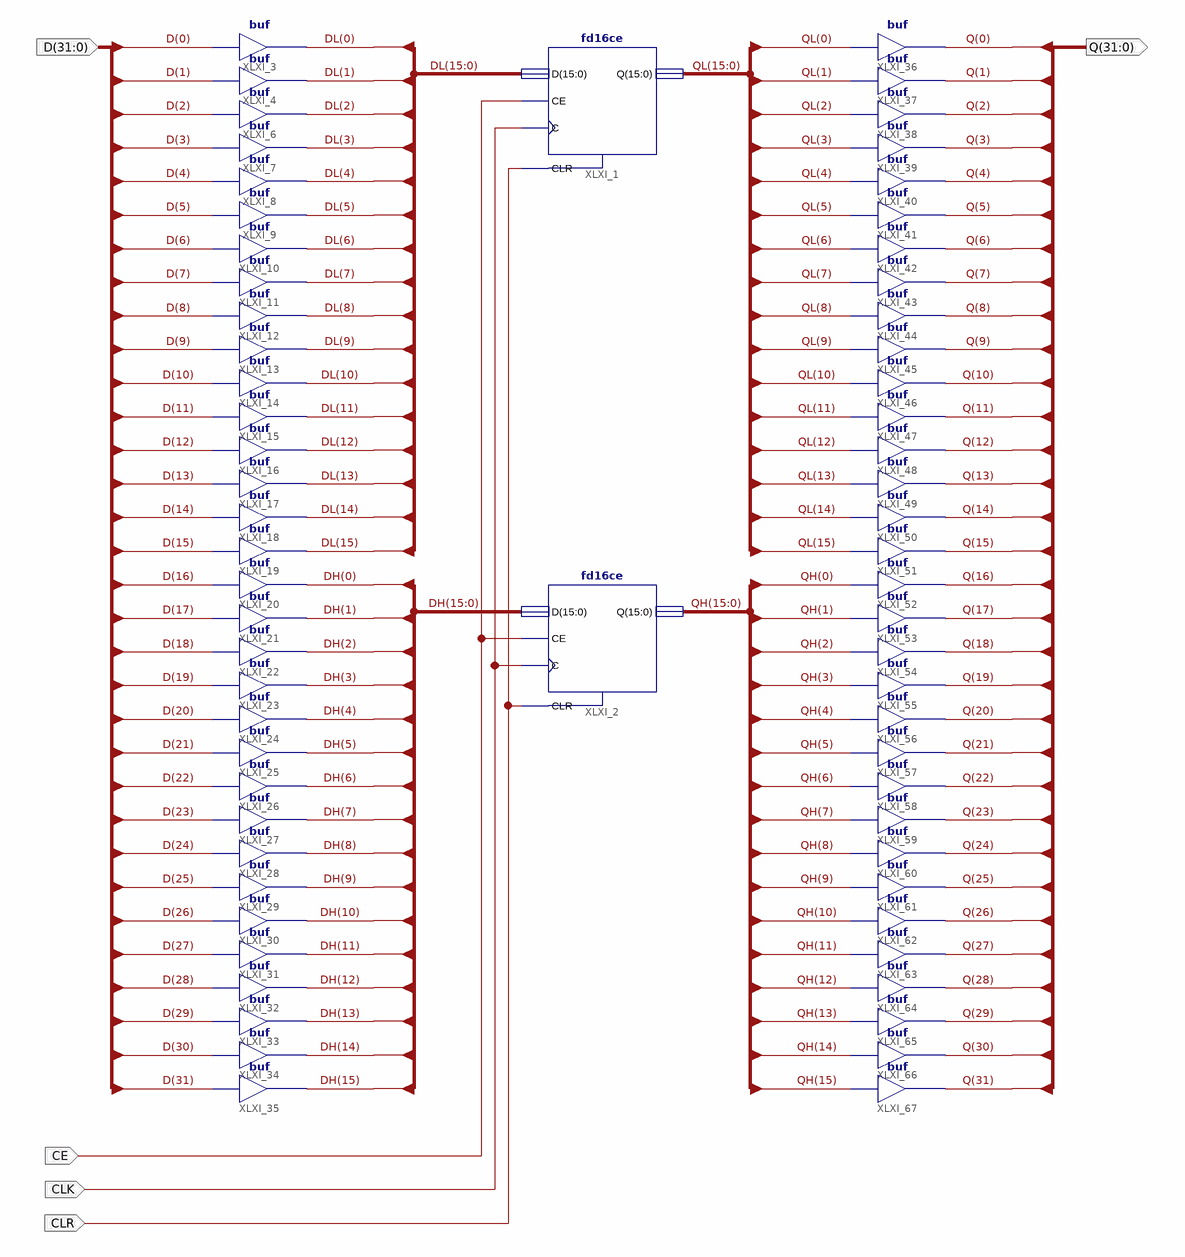
[diagram p0: schematic sheet 1]
// Xilinx ISE schematic fd32ce.sch (spartan6) as structural Verilog: 66 symbols, 5 ports
module fd32ce (
  input  [31:0] D,
  input  CLR,
  input  CLK,
  input  CE,
  output [31:0] Q
);

  wire [15:0] DH, DL, QH, QL;

  fd16ce XLXI_1 (.C(CLK), .CE(CE), .CLR(CLR), .D(DL), .Q(QL));
  fd16ce XLXI_2 (.C(CLK), .CE(CE), .CLR(CLR), .D(DH), .Q(QH));
  buf XLXI_3 (DL[0], D[0]);
  buf XLXI_4 (DL[1], D[1]);
  buf XLXI_6 (DL[2], D[2]);
  buf XLXI_7 (DL[3], D[3]);
  buf XLXI_8 (DL[4], D[4]);
  buf XLXI_9 (DL[5], D[5]);
  buf XLXI_10 (DL[6], D[6]);
  buf XLXI_11 (DL[7], D[7]);
  buf XLXI_12 (DL[8], D[8]);
  buf XLXI_13 (DL[9], D[9]);
  buf XLXI_14 (DL[10], D[10]);
  buf XLXI_15 (DL[11], D[11]);
  buf XLXI_16 (DL[12], D[12]);
  buf XLXI_17 (DL[13], D[13]);
  buf XLXI_18 (DL[14], D[14]);
  buf XLXI_19 (DL[15], D[15]);
  buf XLXI_20 (DH[0], D[16]);
  buf XLXI_21 (DH[1], D[17]);
  buf XLXI_22 (DH[2], D[18]);
  buf XLXI_23 (DH[3], D[19]);
  buf XLXI_24 (DH[4], D[20]);
  buf XLXI_25 (DH[5], D[21]);
  buf XLXI_26 (DH[6], D[22]);
  buf XLXI_27 (DH[7], D[23]);
  buf XLXI_28 (DH[8], D[24]);
  buf XLXI_29 (DH[9], D[25]);
  buf XLXI_30 (DH[10], D[26]);
  buf XLXI_31 (DH[11], D[27]);
  buf XLXI_32 (DH[12], D[28]);
  buf XLXI_33 (DH[13], D[29]);
  buf XLXI_34 (DH[14], D[30]);
  buf XLXI_35 (DH[15], D[31]);
  buf XLXI_36 (Q[0], QL[0]);
  buf XLXI_37 (Q[1], QL[1]);
  buf XLXI_38 (Q[2], QL[2]);
  buf XLXI_39 (Q[3], QL[3]);
  buf XLXI_40 (Q[4], QL[4]);
  buf XLXI_41 (Q[5], QL[5]);
  buf XLXI_42 (Q[6], QL[6]);
  buf XLXI_43 (Q[7], QL[7]);
  buf XLXI_44 (Q[8], QL[8]);
  buf XLXI_45 (Q[9], QL[9]);
  buf XLXI_46 (Q[10], QL[10]);
  buf XLXI_47 (Q[11], QL[11]);
  buf XLXI_48 (Q[12], QL[12]);
  buf XLXI_49 (Q[13], QL[13]);
  buf XLXI_50 (Q[14], QL[14]);
  buf XLXI_51 (Q[15], QL[15]);
  buf XLXI_52 (Q[16], QH[0]);
  buf XLXI_53 (Q[17], QH[1]);
  buf XLXI_54 (Q[18], QH[2]);
  buf XLXI_55 (Q[19], QH[3]);
  buf XLXI_56 (Q[20], QH[4]);
  buf XLXI_57 (Q[21], QH[5]);
  buf XLXI_58 (Q[22], QH[6]);
  buf XLXI_59 (Q[23], QH[7]);
  buf XLXI_60 (Q[24], QH[8]);
  buf XLXI_61 (Q[25], QH[9]);
  buf XLXI_62 (Q[26], QH[10]);
  buf XLXI_63 (Q[27], QH[11]);
  buf XLXI_64 (Q[28], QH[12]);
  buf XLXI_65 (Q[29], QH[13]);
  buf XLXI_66 (Q[30], QH[14]);
  buf XLXI_67 (Q[31], QH[15]);
endmodule
